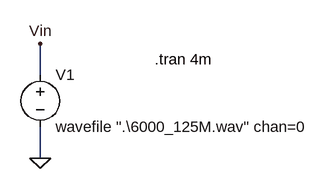
[diagram p0: schematic 002.asc]
002.asc, the LTspice schematic file:
Version 4
SHEET 1 1648 680
WIRE 80 128 80 80
WIRE 80 256 80 208
FLAG 80 256 0
FLAG 80 80 Vin
SYMBOL voltage 80 112 R0
SYMATTR InstName V1
SYMATTR Value wavefile ".\6000_125M.wav" chan=0
TEXT 256 104 Left 2 !.tran 4m

The netlist it stands for:
* 002.asc
V1 Vin 0 wavefile ".\6000_125M.wav" chan=0
.tran 4m
.backanno
.end